# EasyEDA Pro project REV5.eprj

# Schematic UNCZ SLIME REV05
Board Name: Board1; Create Date: 2026-05-08; Page Name: P1; Project Name: REV5; Schematic Name: UNCZ SLIME REV05; Update Date: 2026-05-22; Company: UNCZ; Page Size: A4; Version: REV 5
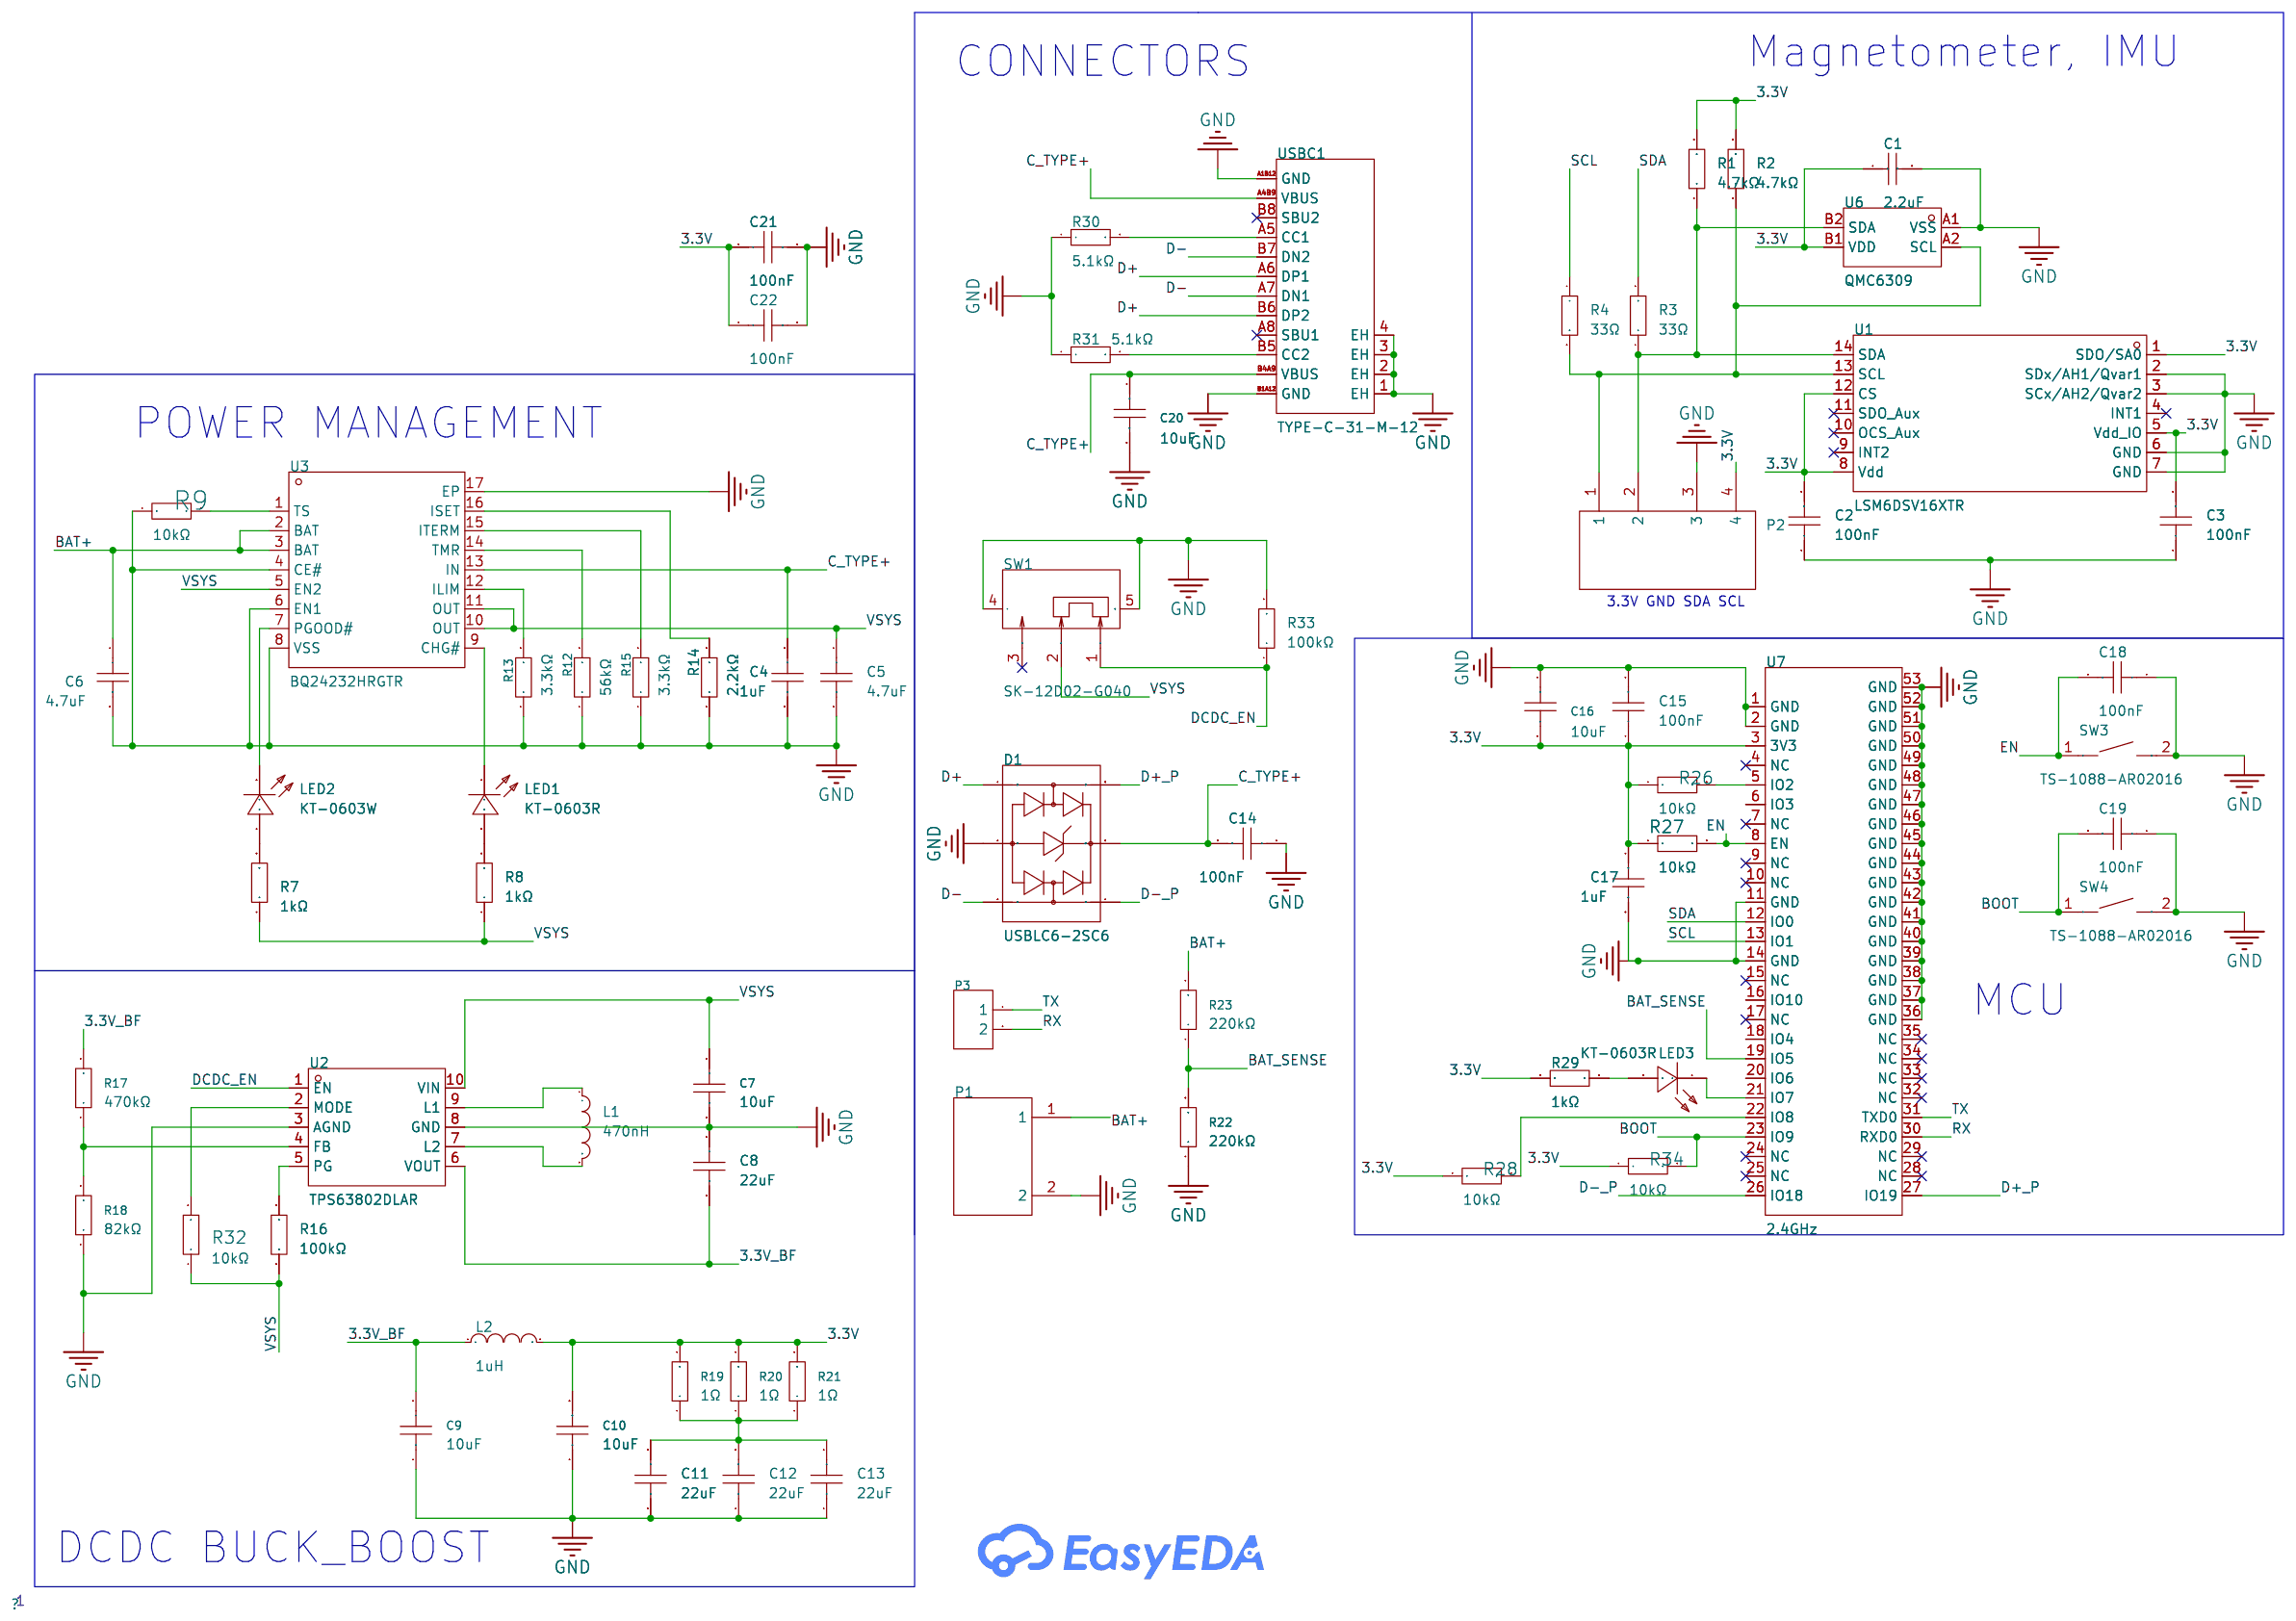
[diagram p0: schematic sheet]

## Parts
C1  2.2uF  [C0603]
C2  100nF  [C0603]
C3  100nF  [C0603]
C4  1uF  [C0603]
C5  4.7uF  [C0603]
C6  4.7uF  [C0603]
C7  10uF  [C0603]
C8  22uF  [C0805]
C9  10uF  [C0603]
C10  10uF  [C0603]
C11  22uF  [C0805]
C12  22uF  [C0805]
C13  22uF  [C0805]
C14  100nF  [C0603]
C15  100nF  [C0603]
C16  10uF  [C0603]
C17  1uF  [C0603]
C18  100nF  [C0603]
C19  100nF  [C0603]
C20  10uF  [C0603]
C21  100nF  [C0402]
C22  100nF  [C0402]
D1  USBLC6-2SC6  [SOT-23-6_L2.9-W1.6-P0.95-LS2.8-BL]
L1  470nH  [IND-SMD_L2.0-W1.6-1]  (no BOM)
L2  1uH  [IND-SMD_L3.2-W2.5-1]  (no BOM)
LED1  KT-0603R  [LED0603-RD_1]
LED2  KT-0603W  [LED0603-R-RD_WHITE]
LED3  KT-0603R  [LED0603-RD_1]
P1  -  [SMW-250-02P]  (no BOM)
P2  -  [SMW-250-04P]  (no BOM)
P3  -  [HDR-TH_2P-P2.54-V-F]  (no BOM)
R1  4.7kΩ  [R0603]
R2  4.7kΩ  [R0603]
R3  33Ω  [R0603]
R4  33Ω  [R0603]
R7  1kΩ  [R0603]
R8  1kΩ  [R0603]
R9  10kΩ  [R0603]
R12  56kΩ  [R0603]
R13  3.3kΩ  [R0603]
R14  2.2kΩ  [R0603]
R15  3.3kΩ  [R0603]
R16  100kΩ  [R0603]
R17  470kΩ  [R0603]
R18  82kΩ  [R0603]
R19  1Ω  [R0603]
R20  1Ω  [R0603]
R21  1Ω  [R0603]
R22  220kΩ  [R0603]
R23  220kΩ  [R0603]
R26  10kΩ  [R0603]
R27  10kΩ  [R0603]
R28  10kΩ  [R0603]
R29  1kΩ  [R0603]
R30  5.1kΩ  [R0603]
R31  5.1kΩ  [R0603]
R32  10kΩ  [R0603]
R33  100kΩ  [R0603]
R34  10kΩ  [R0603]
SW1  SK-12D02-G040  [SW-TH_SK-12D02-G040]  (no BOM)
SW3  TS-1088-AR02016  [SW-SMD_L3.9-W3.0-P4.45]
SW4  TS-1088-AR02016  [SW-SMD_L3.9-W3.0-P4.45]
U1  LSM6DSV16XTR  [LGA-14_L3.0-W2.5-P0.50-BR]
U2  TPS63802DLAR  [VSON-10_L3.0-W2.0-P0.50-TL]
U3  BQ24232HRGTR  [VQFN-16_L3.0-W3.0-P0.50-TL-EP1.7]
U6  QMC6309  [X1-WLB0808-4_L0.8-W0.8-P0.40-TL]
U7  2.4GHz  [WIFIM-SMD_ESP32-C3-MINI-1]
USBC1  TYPE-C-31-M-12  [USB-C_SMD-TYPE-C-31-M-12_1]

## Library data of the parts
C1 = CL10A225KO8NNNC: LCSC Part Name: 2.2uF ±10% 16V; Supplier Part: C23630; Manufacturer: SAMSUNG(三星); Supplier Footprint: 0603; JLCPCB Part Class: Basic Part; Datasheet: https://item.szlcsc.com/datasheet/CL10A225KO8NNNC/24366.html; Supplier: LCSC; Tolerance: ±10%; Voltage Rating: 16V; Temperature Coefficient: X5R; Check: true
C2 C3 C14 C15 C18 C19 = CC0603KRX7R9BB104: LCSC Part Name: 100nF ±10% 50V; Supplier Part: C14663; Manufacturer: YAGEO(国巨); Supplier Footprint: 0603; JLCPCB Part Class: Basic Part; Datasheet: https://item.szlcsc.com/datasheet/CC0603KRX7R9BB104/15331.html; Supplier: LCSC; Tolerance: ±10%; Voltage Rating: 50V; Temperature Coefficient: X7R; Check: true
C4 C17 = CL10A105KB8NNNC: LCSC Part Name: 1uF ±10% 50V; Supplier Part: C15849; Manufacturer: SAMSUNG(三星); Supplier Footprint: 0603; JLCPCB Part Class: Basic Part; Datasheet: https://item.szlcsc.com/datasheet/CL10A105KB8NNNC/16531.html; Supplier: LCSC; Tolerance: ±10%; Voltage Rating: 50V; Temperature Coefficient: X5R; Check: true
C5 C6 = CL10A475KO8NNNC: LCSC Part Name: 4.7uF ±10% 16V; Supplier Part: C19666; Manufacturer: SAMSUNG(三星); Supplier Footprint: 0603; JLCPCB Part Class: Basic Part; Datasheet: https://item.szlcsc.com/datasheet/CL10A475KO8NNNC/20375.html; Supplier: LCSC; Tolerance: ±10%; Voltage Rating: 16V; Temperature Coefficient: X5R; Check: true
C7 C9 C10 C16 C20 = CL10A106MA8NRNC: LCSC Part Name: 10uF ±20% 25V; Supplier Part: C96446; Manufacturer: SAMSUNG(三星); Supplier Footprint: 0603; JLCPCB Part Class: Basic Part; Datasheet: https://item.szlcsc.com/datasheet/CL10A106MA8NRNC/97651.html; Supplier: LCSC; Tolerance: ±20%; Voltage Rating: 25V; Temperature Coefficient: X5R; Check: true
C8 C11-C13 = CL21A226MAQNNNE: LCSC Part Name: 22uF ±20% 25V; Supplier Part: C45783; Manufacturer: SAMSUNG(三星); Supplier Footprint: 0805; JLCPCB Part Class: Basic Part; Datasheet: https://item.szlcsc.com/datasheet/CL21A226MAQNNNE/46786.html; Supplier: LCSC; Tolerance: ±20%; Voltage Rating: 25V; Temperature Coefficient: X5R; Check: true
C21 C22 = CL05B104KO5NNNC: LCSC Part Name: 100nF ±10% 16V; Supplier Part: C1525; Manufacturer: SAMSUNG(三星); Supplier Footprint: 0402; JLCPCB Part Class: Basic Part; Datasheet: https://item.szlcsc.com/datasheet/CL05B104KO5NNNC/1877.html; Supplier: LCSC; Tolerance: ±10%; Voltage Rating: 16V; Temperature Coefficient: X7R
D1 = USBLC6-2SC6_C21713975: LCSC Part Name: 丝印UL26 单向TVS 5V截止 峰值脉冲电流：4.5A@8/20us; Supplier Part: C21713975; Manufacturer: GOODWORK(固得沃克); Supplier Footprint: SOT-23-6; JLCPCB Part Class: Extended Part; Datasheet: https://item.szlcsc.com/datasheet/USBLC6-2SC6/23140168.html; Supplier: LCSC; Polarity: Unidirectional; Reverse Stand-Off Voltage (Vrwm): 5V; Clamping Voltage: 14V; Peak Pulse Current (Ipp): 4.5A@8/20us; Peak Pulse Power Dissipation (Ppp): 60W@8/20us; Voltage - Breakdown: 6V; Reverse Leakage Current (Ir): 500nA; Number of Channels: 2; Operating Temperature: -55℃~+125℃; level of protection: IEC 61000-4-5；IEC 61000-4-2; Type: TVS; Junction Capacitance: 0.6pF
L1 = DFE201612E-R47M=P2: LCSC Part Name: 470nH ±20% 5.5A; Supplier Part: C668312; Manufacturer: muRata(村田); Supplier Footprint: 0806; JLCPCB Part Class: Extended Part; Datasheet: https://atta.szlcsc.com/upload/public/pdf/source/20220704/803E7827D5B93CBE7ABCC328F9E8474C.pdf; Supplier: LCSC; Tolerance: ±20%; Current Rating: 4.5A; Current - Saturation(Isat): 5.5A; DC Resistance(DCR): 26mΩ
L2 = TMS322512ALM-1R0MTAA: LCSC Part Name: 1uH ±20% 4.6A; Supplier Part: C5159968; Manufacturer: TDK; Supplier Footprint: 1210; JLCPCB Part Class: Extended Part; Datasheet: https://atta.szlcsc.com/upload/public/pdf/source/20240117/93D08EA87E96D4335E3C24C1E97B0685.pdf; Supplier: LCSC; Tolerance: ±20%; Saturation Current (Isat): 4.6A
LED1 LED3 = KT-0603R: LCSC Part Name: 0603 红灯 高亮; Supplier Part: C2286; Manufacturer: KENTO; Supplier Footprint: 0603; JLCPCB Part Class: Basic Part; Datasheet: https://item.szlcsc.com/datasheet/KT-0603R/2659.html; Supplier: LCSC; Illumination Color: Red; Voltage - Forward(Vf): 1.8V~2.4V; Power(Watts): 40mW; Forward Current: 20mA; Wavelength - Dominant: 615nm~630nm; Peak Wavelength: 645nm; Diode Configuration: Discrete Diode; Lens Color: Water Clear; Luminous Intensity: 300mcd; Viewing Angle: 120°; Operating Temperature: -40℃~+85℃; Check: true
LED2 = KT-0603W: LCSC Part Name: 0603 白灯 高亮; Supplier Part: C2290; Manufacturer: KENTO; Supplier Footprint: 0603; JLCPCB Part Class: Basic Part; Datasheet: https://item.szlcsc.com/datasheet/KT-0603W/2663.html; Supplier: LCSC; Illumination Color: White; Voltage - Forward(Vf): 2.6V~3.1V; Power(Watts): 100mW; Forward Current: 5mA; Diode Configuration: Discrete Diode; Lens Color: Yellow Lens; Luminous Intensity: 360mcd; Viewing Angle: 120°; Mounting Style: Top-mount; Operating Temperature: -40℃~+85℃; Check: true
P1 = SMW-250-02P
P2 = SMW-250-04P
P3 = HDR-F_2.54_1x2P: Supplier Footprint: Through
R1 R2 = 0603WAF4701T5E: LCSC Part Name: 4.7kΩ ±1% 100mW 厚膜电阻; Supplier Part: C23162; Manufacturer: UNI-ROYAL(厚声); Supplier Footprint: 0603; JLCPCB Part Class: Basic Part; Datasheet: https://item.szlcsc.com/datasheet/0603WAF4701T5E/23889.html; Supplier: LCSC; Type: Thick Film Resistor; Tolerance: ±1%; Power(Watts): 100mW; Voltage-Supply(Max): 75V; Temperature Coefficient: ±100ppm/℃; Operating Temperature: -55℃~+155℃; Check: true
R3 R4 = 0603WAF330JT5E: LCSC Part Name: 33Ω ±1% 100mW 厚膜电阻; Supplier Part: C23140; Manufacturer: UNI-ROYAL(厚声); Supplier Footprint: 0603; JLCPCB Part Class: Basic Part; Datasheet: https://item.szlcsc.com/datasheet/0603WAF330JT5E/23867.html; Supplier: LCSC; Type: Thick Film Resistor; Tolerance: ±1%; Power(Watts): 100mW; Voltage-Supply(Max): 75V; Temperature Coefficient: ±100ppm/℃; Operating Temperature: -55℃~+155℃; Check: true
R7 R8 R29 = 0603WAF1001T5E: LCSC Part Name: 1kΩ ±1% 100mW 厚膜电阻; Supplier Part: C21190; Manufacturer: UNI-ROYAL(厚声); Supplier Footprint: 0603; JLCPCB Part Class: Basic Part; Datasheet: https://item.szlcsc.com/datasheet/0603WAF1001T5E/21904.html; Supplier: LCSC; Type: Thick Film Resistor; Tolerance: ±1%; Power(Watts): 100mW; Voltage-Supply(Max): 75V; Temperature Coefficient: ±100ppm/℃; Operating Temperature: -55℃~+155℃; Check: true
R9 R26-R28 R32 R34 = 0603WAF1002T5E: LCSC Part Name: 厚膜电阻 10kΩ ±1% 100mW; Supplier Part: C25804; Manufacturer: UNI-ROYAL(厚声); Supplier Footprint: 0603; JLCPCB Part Class: Basic Part; Datasheet: https://item.szlcsc.com/datasheet/0603WAF1002T5E/26547.html; Supplier: LCSC; Type: Thick Film Resistor; Tolerance: ±1%; Power(Watts): 100mW; Voltage-Supply(Max): 75V; Temperature Coefficient: ±100ppm/℃; Operating Temperature: -55℃~+155℃; Check: true
R12 = 0603WAF5602T5E: LCSC Part Name: 56kΩ ±1% 100mW 厚膜电阻; Supplier Part: C23206; Manufacturer: UNI-ROYAL(厚声); Supplier Footprint: 0603; JLCPCB Part Class: Basic Part; Datasheet: https://item.szlcsc.com/datasheet/0603WAF5602T5E/23933.html; Supplier: LCSC; Type: Thick Film Resistor; Tolerance: ±1%; Power(Watts): 100mW; Voltage-Supply(Max): 75V; Temperature Coefficient: ±100ppm/℃; Operating Temperature: -55℃~+155℃; Check: true
R13 R15 = 0603WAF3301T5E: LCSC Part Name: 3.3kΩ ±1% 100mW 厚膜电阻; Supplier Part: C22978; Manufacturer: UNI-ROYAL(厚声); Supplier Footprint: 0603; JLCPCB Part Class: Basic Part; Datasheet: https://item.szlcsc.com/datasheet/0603WAF3301T5E/23705.html; Supplier: LCSC; Type: Thick Film Resistor; Tolerance: ±1%; Power(Watts): 100mW; Voltage-Supply(Max): 75V; Temperature Coefficient: ±100ppm/℃; Operating Temperature: -55℃~+155℃; Check: true
R14 = 0603WAF2201T5E_C4190: LCSC Part Name: 2.2kΩ ±1% 100mW 厚膜电阻; Supplier Part: C4190; Manufacturer: UNI-ROYAL(厚声); Manufacturer Part: 0603WAF2201T5E; Supplier Footprint: 0603; JLCPCB Part Class: Basic Part; Datasheet: https://atta.szlcsc.com/upload/public/pdf/source/20200306/C422600_1E6D84923E4A46A82E41ADD87F860B5C.pdf; Supplier: LCSC; Type: Thick Film Resistors; Tolerance: ±1%; Temperature Coefficient: ±100ppm/℃; Operating Temperature Range: -55℃~+155℃; Check: true
R16 R33 = 0603WAF1003T5E: LCSC Part Name: 100kΩ ±1% 100mW 厚膜电阻; Supplier Part: C25803; Manufacturer: UNI-ROYAL(厚声); Supplier Footprint: 0603; JLCPCB Part Class: Basic Part; Datasheet: https://item.szlcsc.com/datasheet/0603WAF1003T5E/26546.html; Supplier: LCSC; Type: Thick Film Resistor; Tolerance: ±1%; Power(Watts): 100mW; Voltage-Supply(Max): 75V; Temperature Coefficient: ±100ppm/℃; Operating Temperature: -55℃~+155℃; Check: true
R17 = 0603WAF4703T5E: LCSC Part Name: 470kΩ ±1% 100mW 厚膜电阻; Supplier Part: C23178; Manufacturer: UNI-ROYAL(厚声); Supplier Footprint: 0603; JLCPCB Part Class: Basic Part; Datasheet: https://item.szlcsc.com/datasheet/0603WAF4703T5E/23905.html; Supplier: LCSC; Type: Thick Film Resistor; Tolerance: ±1%; Power(Watts): 100mW; Voltage-Supply(Max): 75V; Temperature Coefficient: ±100ppm/℃; Operating Temperature: -55℃~+155℃; Check: true
R18 = 0603WAF8202T5E: LCSC Part Name: 82kΩ ±1% 100mW 厚膜电阻; Supplier Part: C23254; Manufacturer: UNI-ROYAL(厚声); Supplier Footprint: 0603; JLCPCB Part Class: Basic Part; Datasheet: https://item.szlcsc.com/datasheet/0603WAF8202T5E/23981.html; Supplier: LCSC; Type: Thick Film Resistor; Tolerance: ±1%; Power(Watts): 100mW; Voltage-Supply(Max): 75V; Temperature Coefficient: ±100ppm/℃; Operating Temperature: -55℃~+155℃; Check: true
R19-R21 = 0603WAF100KT5E: LCSC Part Name: 1Ω ±1% 100mW 厚膜电阻; Supplier Part: C22936; Manufacturer: UNI-ROYAL(厚声); Supplier Footprint: 0603; JLCPCB Part Class: Basic Part; Datasheet: https://item.szlcsc.com/datasheet/0603WAF100KT5E/23663.html; Supplier: LCSC; Type: Thick Film Resistor; Tolerance: ±1%; Power(Watts): 100mW; Voltage-Supply(Max): 75V; Temperature Coefficient: ±400ppm/℃; Operating Temperature: -55℃~+155℃; Check: true
R22 R23 = 0603WAF2203T5E: LCSC Part Name: 220kΩ ±1% 100mW 厚膜电阻; Supplier Part: C22961; Manufacturer: UNI-ROYAL(厚声); Supplier Footprint: 0603; JLCPCB Part Class: Basic Part; Datasheet: https://item.szlcsc.com/datasheet/0603WAF2203T5E/23688.html; Supplier: LCSC; Type: Thick Film Resistor; Tolerance: ±1%; Power(Watts): 100mW; Voltage-Supply(Max): 75V; Temperature Coefficient: ±100ppm/℃; Operating Temperature: -55℃~+155℃; Check: true
R30 R31 = 0603WAF5101T5E: LCSC Part Name: 5.1kΩ ±1% 100mW 厚膜电阻; Supplier Part: C23186; Manufacturer: UNI-ROYAL(厚声); Supplier Footprint: 0603; JLCPCB Part Class: Basic Part; Datasheet: https://item.szlcsc.com/datasheet/0603WAF5101T5E/23913.html; Supplier: LCSC; Type: Thick Film Resistor; Tolerance: ±1%; Power(Watts): 100mW; Voltage-Supply(Max): 75V; Temperature Coefficient: ±100ppm/℃; Operating Temperature: -55℃~+155℃; Check: true
SW1 = SK-12D02-G040: LCSC Part Name: 柄长4mm 卧插两档 滑动开关; Supplier Part: C2930976; Manufacturer: G-Switch(品赞); Supplier Footprint: 弯插,8.6x4.7mm; JLCPCB Part Class: Extended Part; Datasheet: https://item.szlcsc.com/datasheet/SK-12D02-G040/3269893.html; Supplier: LCSC; Circuit: SPDT; Actuator Style: Rectangular Columnar; Termination Style: PC Pin; Length: 8.6mm; Width: 4.7mm; Switch Height: 8.5mm; Mounting Type: Right Angle; Actuator Color: Black; Current Rating: 1A; Voltage Rating: 24V; Life: 10,000 Cycles; Operating Temperature: -25℃~+70℃
SW3 SW4 = TS-1088-AR02016: LCSC Part Name: 4*3*2mm 立贴 轻触开关; Supplier Part: C720477; Manufacturer: XUNPU(讯普); Supplier Footprint: SMD,4x3mm; JLCPCB Part Class: Basic Part; Datasheet: https://item.szlcsc.com/datasheet/TS-1088-AR02016/763484.html; Supplier: LCSC; Circuit: SPST; Actuator Style: Round Button; Operating Force: 1.6N; Mounting Type: Surface Mount,Vertical; Length: 4mm; Width: 3mm; Switch Height: 2mm; with Bracket: Without Bracket; Contact Current: 50mA; Voltage Rating: 12V; Actuator/Cap Color: Black; Termination Style: SMD(SMT) Tab; Life: 100,000 Cycles; Operating Temperature: -30℃~+80℃; Check: true
U1 = LSM6DSV16XTR: LCSC Part Name: 适用于高端应用的六轴惯性测量单元（IMU）和具备嵌入式传感器融合功能的Al传感器、Qvar; Supplier Part: C5267406; Manufacturer: ST(意法半导体); Supplier Footprint: LGA-14(2.5x3); JLCPCB Part Class: Extended Part; Datasheet: https://item.szlcsc.com/datasheet/LSM6DSV16XTR/5993815.html; Supplier: LCSC; Accelerometer Sensing Axis: X,Y,Z; Acceleration Measurement Range (MAX): ±16g; Gyroscope Sensing Axis: X,Y,Z; Gyroscope Measurement Range (MAX): ±4000dps; Sensor Type: IMU (accelerometer + gyroscope); Interface: I2C；SPI; Voltage - Supply: 1.71V~3.6V; Cache Size: 4.5KB; Standby Current: 2.6uA; Operating Temperature: -40℃~+85℃; Features: Motion event detection；Synchronization and timestamp; Check: true
U2 = TPS63802DLAR_C2845237: LCSC Part Name: 采用DFN封装的高效率、低IQ降压/升压转换器; Supplier Part: C2845237; Manufacturer: TI(德州仪器); Supplier Footprint: VSON-10(2x3); JLCPCB Part Class: Extended Part; Datasheet: https://www.ti.com/cn/lit/gpn/tps63802; Supplier: LCSC; Function: Buck-Boost; Voltage - Supply: 1.3V~5.5V; Output Current: 2A; Frequency - Switching: 2.1MHz；1.4MHz；1.6MHz; Operating Temperature: -40℃~+125℃@(TJ); Number of Outputs: 1; Topology: Buck-Boost; Switch tube (built-in/external): Built-In; Check: true
U3 = BQ24232HRGTR: Supplier Part: C575586; Manufacturer: TI(德州仪器); Supplier Footprint: VQFN-16-EP(3x3); JLCPCB Part Class: Extended Part; Datasheet: https://www.ti.com/cn/lit/gpn/bq24232h; Supplier: LCSC; Voltage - Supply: 4.35V~10.2V; Charging Saturation Voltage: 4.35V; Type of Battery: Lithium-ion/Polymer; Number of Cells: 1; Operating Temperature: -40℃~+85℃; Check: true
U6 = QMC6309: LCSC Part Name: 三轴单芯片磁传感器; Supplier Part: C5439871; Manufacturer: QST(上海矽睿); Supplier Footprint: WLCSP-4(0.8x0.8); JLCPCB Part Class: Extended Part; Datasheet: https://item.szlcsc.com/datasheet/QMC6309/6319593.html; Supplier: LCSC; Magnetic Sensing Range(X,Y): ±3.2mT; Magnetic Sensing Range(Z): ±3.2mT; Output bit: 16bit; Interface Type: I2C; Voltage - Supply: 2.5V~3.6V; Current - Supply: 10uA；6uA; Operating Temperature: -40℃~+85℃; Check: true
U7 = ESP32-C3-MINI-1-H4X: LCSC Part Name: 不带固件 支持2.4GHz Wi-Fi和蓝牙5的小尺寸模组; Supplier Part: C41349510; Manufacturer: ESPRESSIF(乐鑫); Supplier Footprint: SMD,16.6x13.2mm; JLCPCB Part Class: Extended Part; Datasheet: https://item.szlcsc.com/datasheet/ESP32-C3-MINI-1-H4X/43083447.html; Supplier: LCSC; Utilized IC / Part: ESP32-C3FH4; Interface Type: I2C；GPIO；UART；SPI；USB；I2S; Antenna Type: On-board PCB Antenna; Output Power: 20.5dBm; Voltage - Supply: 3V~3.6V; Receive  Current: 82mA; Send  Current: 350mA; Sensitivity: -104dBm; Operating Temperature: -40℃~+105℃; Check: true
USBC1 = TYPE-C-31-M-12: LCSC Part Name: Type-C 母 卧贴; Supplier Part: C165948; Manufacturer: 韩国韩荣; Supplier Footprint: SMD; JLCPCB Part Class: Extended Part; Datasheet: https://item.szlcsc.com/datasheet/TYPE-C-31-M-12/177331.html; Supplier: LCSC; Connector Type: Type-C; Gender: Female; Mounting Type: Surface Mount, Right Angle; Number of Contacts: 16P; Number of Ports: 1; Current Rating-Power: 5A; Voltage Rating: 20V; Connect-Disconnect Life: 10,000 cycles; Length: 7.35mm; Operating Temperature: -30℃~+80℃; Check: true

## Nets
3.3V: C1.1 C2.2 C3.2 C10.2 C15.1 C16.2 C17.1 C21.1 C22.1 L2.2 P2.4 R1.2 R2.2 R19.2 R20.2 R21.2 R26.1 R27.1 R28.1 R29.2 R34.1 U1.1(SDO/SA0) U1.5(Vdd_IO) U1.8(Vdd) U1.12(CS) U6.B1(VDD) U7.3(3V3)
3.3V_BF: C8.2 C9.2 L2.1 R17.2 U2.6(VOUT)
GND: C1.2 C2.1 C3.1 C4.2 C5.2 C6.2 C7.2 C8.1 C9.1 C10.1 C11.1 C12.1 C13.1 C14.1 C15.2 C16.1 C17.2 C18.1 C19.1 C20.2 C21.2 C22.2 D1.2(GND) P1.2 P2.3 R9.1 R12.1 R13.1 R14.1 R15.1 R18.1 R22.1 R30.1 R31.1 R33.2 SW1.4 SW1.5 SW3.2 SW4.2 U1.2(SDx/AH1/Qvar1) U1.3(SCx/AH2/Qvar2) U1.6(GND) U1.7(GND) U2.3(AGND) U2.8(GND) U3.4(CE#) U3.6(EN1) U3.8(VSS) U3.17(EP) U6.A1(VSS) U7.1(GND) U7.2(GND) U7.11(GND) U7.14(GND) U7.36(GND) U7.37(GND) U7.38(GND) U7.39(GND) U7.40(GND) U7.41(GND) U7.42(GND) U7.43(GND) U7.44(GND) U7.45(GND) U7.46(GND) U7.47(GND) U7.48(GND) U7.49(GND) U7.50(GND) U7.51(GND) U7.52(GND) U7.53(GND) USBC1.1(EH) USBC1.2(EH) USBC1.3(EH) USBC1.4(EH) USBC1.A1B12(GND) USBC1.B1A12(GND)
BAT+: C6.1 P1.1 R23.2 U3.2(BAT) U3.3(BAT)
BAT_SENSE: R22.2 R23.1 U7.19(IO5)
BOOT: C19.2 R34.2 SW4.1 U7.23(IO9)
C_TYPE+: C4.1 C14.2 C20.1 D1.5(VBUS) U3.13(IN) USBC1.A4B9(VBUS) USBC1.B4A9(VBUS)
D+: D1.1(I/O1) USBC1.A6(DP1) USBC1.B6(DP2)
D+_P: D1.6(I/O1) U7.27(IO19)
D-: D1.3(I/O2) USBC1.A7(DN1) USBC1.B7(DN2)
D-_P: D1.4(I/O2) U7.26(IO18)
DCDC_EN: R33.1 SW1.1 U2.1(EN)
EN: C18.2 R27.2 SW3.1 U7.8(EN)
RX: P3.2 U7.30(RXD0)
SCL: R4.1 U7.13(IO1)
SDA: R3.2 U7.12(IO0)
TX: P3.1 U7.31(TXD0)
VSYS: C5.1 C7.1 R7.1 R8.1 R16.1 R32.1 SW1.2 U2.10(VIN) U3.5(EN2) U3.10(OUT) U3.11(OUT)
$1N2531: P2.1 R2.1 R4.2 U1.13(SCL) U6.A2(SCL)
$1N4169: LED1.1(K) U3.9(CHG#)
$1N4171: LED2.2(K) U3.7(PGOOD#)
$1N4227: LED2.1(A) R7.2
$1N4266: LED1.2(A) R8.2
$1N4379: R9.2 U3.1(TS)
$1N4549: R13.2 U3.12(ILIM)
$1N4656: R14.2 U3.16(ISET)
$1N4782: R12.2 U3.14(TMR)
$1N5007: R15.2 U3.15(ITERM)
$1N5303: L1.1 U2.9(L1)
$1N5309: L1.2 U2.7(L2)
$1N5390: R16.2 U2.5(PG)
$1N5546: R17.1 R18.2 U2.4(FB)
$1N6073: C11.2 C12.2 C13.2 R19.1 R20.1 R21.1
$1N10568: R26.2 U7.5(IO2)
$1N10729: R28.2 U7.22(IO8)
$1N11137: LED3.1(K) U7.21(IO7)
$1N11183: LED3.2(A) R29.1
$1N11433: R30.2 USBC1.A5(CC1)
$1N11435: R31.2 USBC1.B5(CC2)
$1N15347: R32.2 U2.2(MODE)
$1N24447: P2.2 R1.1 R3.1 U1.14(SDA) U6.B2(SDA)

Not connected (* = marked no-connect by the designer): SW1 3*; U1 4(INT1)* 9(INT2)* 10(OCS_Aux)* 11(SDO_Aux)*; U7 4(NC)* 6(IO3) 7(NC)* 9(NC)* 10(NC)* 15(NC)* 16(IO10) 17(NC)* 18(IO4) 20(IO6) 24(NC)* 25(NC)* 28(NC)* 29(NC)* 32(NC)* 33(NC)* 34(NC)* 35(NC)*; USBC1 A8(SBU1)* B8(SBU2)*

## Notes on the sheet
- CONNECTORS
- Magnetometer, IMU
- POWER MANAGEMENT
- 3.3V GND SDA SCL
- MCU
- DCDC BUCK_BOOST

# Board PCB1
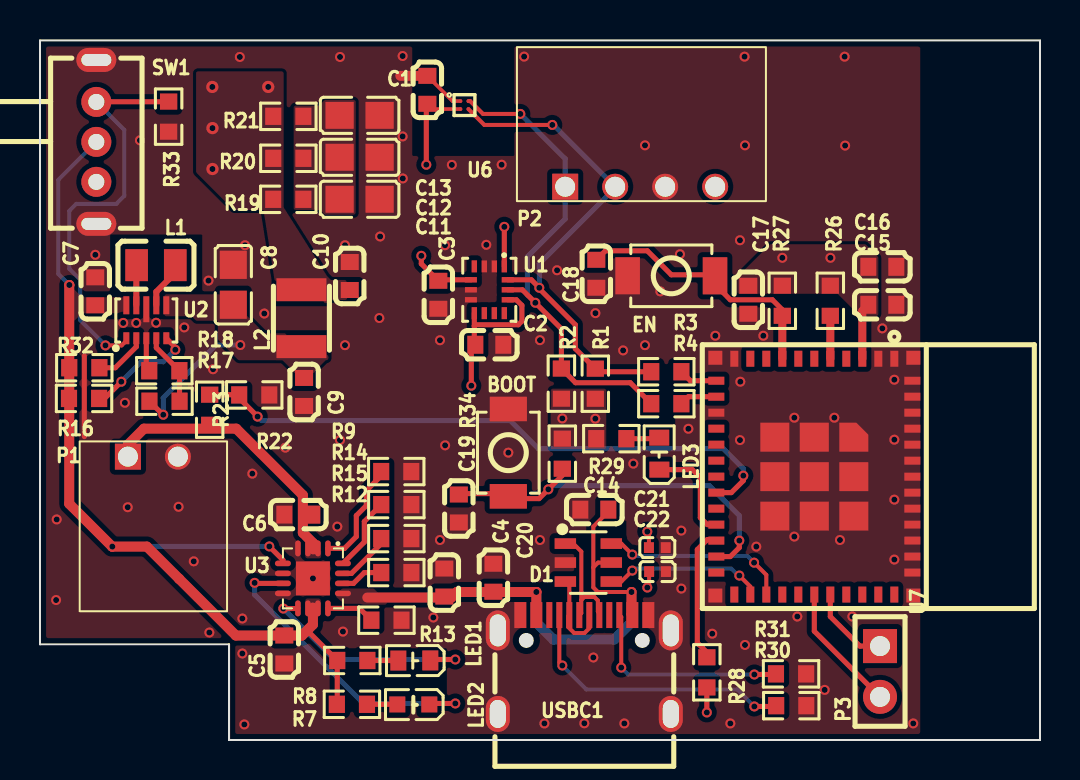
[diagram p1: board, top side]
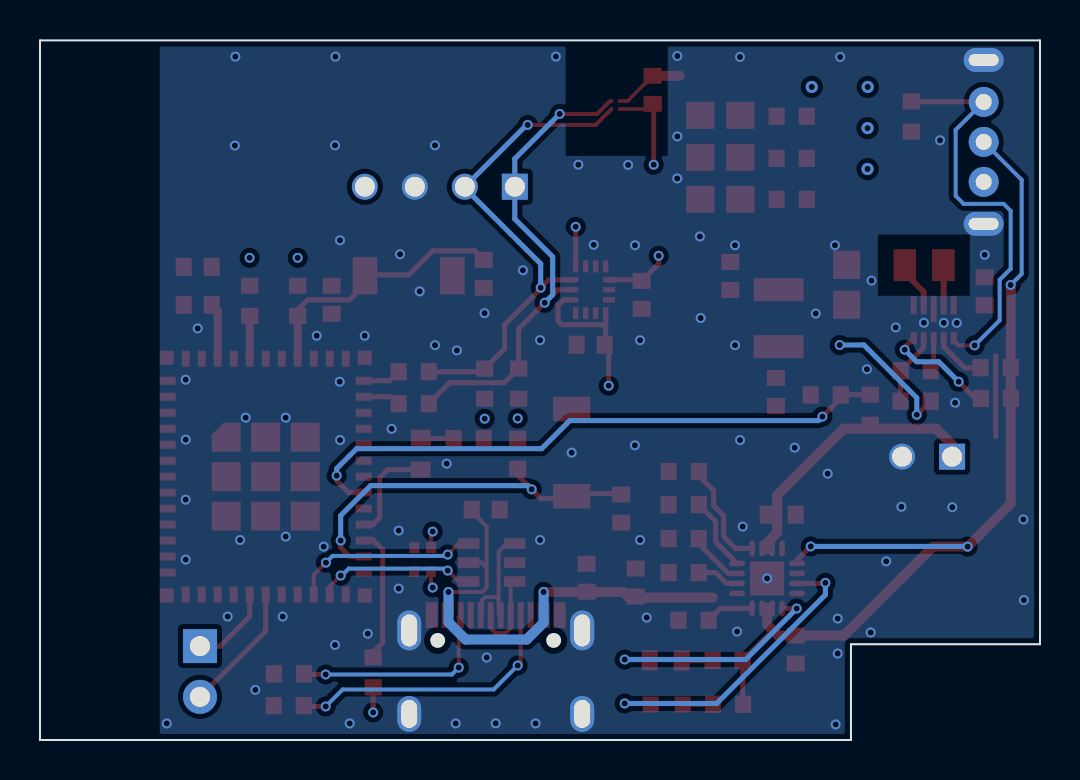
[diagram p2: board, bottom side, seen from below]

Outline 50 x 35.01 mm; copper layers: Top Layer, Inner1, Inner2, Bottom Layer. Coordinates in mm from the lower left corner of the outline.
Outline path: 0,35.01 0,4.79 9.45,4.79 9.45,0 50,0 50,35.01 0,35.01
Stack: Top Layer 0.035mm Outer layer thickness 1oz / Dielectric1 0.2104mm 7628 RC49% 8.6mil / Inner1 0.0152mm Inner layer thickness / Dielectric2 1.065mm 1.1mm H/HOZ Copper / Inner2 0.0152mm Inner layer thickness / Dielectric3 0.2104mm 7628 RC49% 8.6mil / Bottom Layer 0.035mm Outer layer thickness 1oz

## Design rules (mm)
template: Custom Config
spacing copperThickness1oz (default): track to track 0.102, other pairs 0.152 to 0.3
spacing copperThickness2oz: track to track 0.203, other pairs 0.152 to 0.3
track width copperThickness1oz (default): min 0.127, default 0.254, max 2.54
track width copperThickness2oz: min 0.203, default 0.254, max 2.54
differential pair differentialPair (default): width min 0.127, default 0.254, max 2.54; gap min 0.152, default 0.152
via viaSize (default): diameter min 0.5, default 0.5, max 10; hole min 0.3, default 0.305, max 6.3
net 3.3V uses copperRegion1
net VSYS uses copperRegion1
net $1N5303 uses copperRegion1
net $1N5309 uses copperRegion1
net BAT+ uses copperRegion1
net 3.3V_BF uses copperRegion1
pour e732 uses copperRegion1
pour e1700 uses copperRegion1
pour e1703 uses copperRegion1
pour e1796 uses copperRegion1
pour e1802 uses copperRegion1
pour e1811 uses copperRegion1
pour e1922 uses copperRegion1
pour e1860 uses copperRegion1
pour e2965 uses copperRegion1
pour e775 uses copperRegion1
pour e794 uses copperRegion1

## Placement (name value [footprint] x y rotation side)
BOOT  TS-1088-AR02016  [SW-SMD_L3.9-W3.0-P4.45]  23.42 14.38 90 top
C1  2.2uF  [C0603]  19.37 32.53 90 top
C2  100nF  [C0603]  22.47 19.78 180 top
C3  100nF  [C0603]  19.92 22.28 90 top
C4  1uF  [C0603]  20.22 7.88 90 top
C5  4.7uF  [C0603]  12.22 4.53 270 top
C6  4.7uF  [C0603]  12.92 11.28 180 top
C7  10uF  [C0603]  2.76 22.45 90 top
C8  22uF  [C0805]  9.67 22.78 270 top
C9  10uF  [C0603]  13.21 17.42 90 top
C10  10uF  [C0603]  15.49 23.22 270 top
C11  22uF  [C0805]  15.98 27.06 180 top
C12  22uF  [C0805]  15.98 29.16 180 top
C13  22uF  [C0805]  15.98 31.26 180 top
C14  100nF  [C0603]  27.72 11.53 0 top
C15  100nF  [C0603]  42.12 21.78 0 top
C16  10uF  [C0603]  42.12 23.68 180 top
C17  1uF  [C0603]  35.42 22.03 270 top
C18  100nF  [C0603]  27.82 23.33 90 top
C19  100nF  [C0603]  20.94 11.59 90 top
C20  10uF  [C0603]  22.67 8.12 90 top
C21  100nF  [C0402]  30.87 9.63 0 top
C22  100nF  [C0402]  30.88 8.43 0 top
D1  USBLC6-2SC6  [SOT-23-6_L2.9-W1.6-P0.95-LS2.8-BL]  27.42 8.88 270 top
EN  TS-1088-AR02016  [SW-SMD_L3.9-W3.0-P4.45]  31.57 23.23 180 top
L1  470nH  [IND-SMD_L2.0-W1.6-1]  5.8 23.76 0 top
L2  1uH  [IND-SMD_L3.2-W2.5-1]  13.07 21.11 90 top
LED1  KT-0603R  [LED0603-RD_1]  18.72 3.98 180 top
LED2  KT-0603W  [LED0603-R-RD_WHITE]  18.67 1.78 180 top
LED3  KT-0603R  [LED0603-RD_1]  30.97 14.33 90 top
P1  -  [SMW-250-02P]  5.67 14.18 0 top
P2  -  [SMW-250-04P]  29.94 27.69 0 top
P3  -  [HDR-TH_2P-P2.54-V-F]  42 3.43 270 top
R1  4.7kΩ  [R0603]  27.77 17.83 270 top
R2  4.7kΩ  [R0603]  26.07 17.83 270 top
R3  33Ω  [R0603]  31.32 18.43 0 top
R4  33Ω  [R0603]  31.32 16.83 180 top
R7  1kΩ  [R0603]  15.6 1.79 0 top
R8  1kΩ  [R0603]  15.62 3.98 0 top
R9  10kΩ  [R0603]  17.81 13.43 180 top
R12  56kΩ  [R0603]  17.82 8.38 180 top
R13  3.3kΩ  [R0603]  17.32 6 180 top
R14  2.2kΩ  [R0603]  17.82 11.78 180 top
R15  3.3kΩ  [R0603]  17.82 10.08 180 top
R16  100kΩ  [R0603]  2.2 17.09 0 top
R17  470kΩ  [R0603]  6.22 16.95 180 top
R18  82kΩ  [R0603]  6.22 18.48 0 top
R19  1Ω  [R0603]  12.41 27.06 180 top
R20  1Ω  [R0603]  12.42 29.11 180 top
R21  1Ω  [R0603]  12.42 31.21 180 top
R22  220kΩ  [R0603]  10.71 17.27 180 top
R23  220kΩ  [R0603]  8.49 16.53 270 top
R26  10kΩ  [R0603]  39.52 21.98 270 top
R27  10kΩ  [R0603]  37.12 21.98 270 top
R28  10kΩ  [R0603]  33.34 3.39 90 top
R29  1kΩ  [R0603]  28.57 15.08 180 top
R30  5.1kΩ  [R0603]  37.56 1.72 180 top
R31  5.1kΩ  [R0603]  37.55 3.31 180 top
R32  10kΩ  [R0603]  2.22 18.63 0 top
R33  100kΩ  [R0603]  6.43 31.19 270 top
R34  10kΩ  [R0603]  26.12 14.33 270 top
SW1  SK-12D02-G040  [SW-TH_SK-12D02-G040]  2.82 29.93 270 top
U1  LSM6DSV16XTR  [LGA-14_L3.0-W2.5-P0.50-BR]  22.47 22.53 90 top
U2  TPS63802DLAR  [VSON-10_L3.0-W2.0-P0.50-TL]  5.32 20.93 90 top
U3  BQ24232HRGTR  [VQFN-16_L3.0-W3.0-P0.50-TL-EP1.7]  13.65 8.09 270 top
U6  QMC6309  [X1-WLB0808-4_L0.8-W0.8-P0.40-TL]  21.22 31.77 0 top
U7  2.4GHz  [WIFIM-SMD_ESP32-C3-MINI-1]  38.72 13.18 270 top
USBC1  TYPE-C-31-M-12  [USB-C_SMD-TYPE-C-31-M-12_1]  27.22 3.78 0 top

## Footprints (pads in the part's own frame, mm; a bottom-side part is the same pattern mirrored in y, then rotated)
C0402
  rect 0.5x0.54 smd: 1(-0.42,0) 2(0.42,0)
C0603
  rect 0.8x0.9 smd: 1(-0.7,0) 2(0.7,0)
C0805
  rect 1.41x1.35 smd: 1(-1,0) 2(1,0)
HDR-TH_2P-P2.54-V-F
  rect 1.7x1.7 hole 1: 1(-1.27,0)
  round 1.7 hole 1: 2(1.27,0)
IND-SMD_L2.0-W1.6-1
  rect 1.133x1.6 smd: 1(-0.967,0) 2(0.967,0)
IND-SMD_L3.2-W2.5-1
  rect 1.15x2.5 smd: 1(-1.425,0) 2(1.425,0)
LED0603-R-RD_WHITE
  rect 0.8x0.8 smd: 1(0.8,0) 2(-0.8,0)
LED0603-RD_1
  rect 0.8x1 smd: 1(-0.799,-0.004) 2(0.799,0.004)
LGA-14_L3.0-W2.5-P0.50-BR
  rect 0.6x0.27 smd: 1(1.17,-0.75) 2(1.17,-0.25) 3(1.17,0.25) 4(1.17,0.75) 8(-1.17,0.75) 9(-1.17,0.25) 10(-1.17,-0.25) 11(-1.17,-0.75)
  rect 0.27x0.6 smd: 5(0.5,0.92) 6(0,0.92) 7(-0.5,0.92) 12(-0.5,-0.92) 13(0,-0.92) 14(0.5,-0.92)
R0603
  rect 0.806x0.864 smd: 1(-0.753,0) 2(0.753,0)
SMW-250-02P
  rect 1.3x1.3 hole 1: 1(-1.27,0)
  round 1.3 hole 1: 2(1.23,0)
SMW-250-04P
  rect 1.3x1.3 hole 1: 1(-3.683,0)
  round 1.3 hole 1: 2(-1.183,0) 3(1.317,0) 4(3.817,0)
SOT-23-6_L2.9-W1.6-P0.95-LS2.8-BL
  rect 0.532x1.072 smd: 1(-0.95,-1.149) 2(0,-1.149) 3(0.95,-1.149) 4(0.95,1.149) 5(0,1.149) 6(-0.95,1.149)
SW-SMD_L3.9-W3.0-P4.45
  rect 1.23x1.86 smd: 1(-2.185,0) 2(2.185,0)
SW-TH_SK-12D02-G040
  round 1.5 hole 0.8: 1(-2,0) 2(0,0) 3(2,0)
  oval 1.2x2 hole 0.6x1.5: 4(-4.1,0) 5(4.1,0)
USB-C_SMD-TYPE-C-31-M-12_1
  oval 1.2x2 hole 0.8x1.6: 1(4.325,1.706) 4(-4.325,1.706)
  oval 1.2x1.8 hole 0.8x1.4: 2(4.325,-2.474) 3(-4.325,-2.474)
  custom 0.6x1.3 smd: A1B12(-3.2,2.474) A4B9(-2.4,2.474) B1A12(3.2,2.474) B4A9(2.401,2.474)
  rect 0.3x1.3 smd: A5(-1.25,2.474) A6(-0.25,2.474) A7(0.25,2.474) A8(1.25,2.474) B5(1.75,2.474) B6(0.75,2.474) B7(-0.75,2.474) B8(-1.75,2.474)
VQFN-16_L3.0-W3.0-P0.50-TL-EP1.7
  oval 0.8x0.28 smd: 1(-1.5,0.75) 2(-1.5,0.25) 3(-1.5,-0.25) 4(-1.5,-0.75) 9(1.5,-0.75) 10(1.5,-0.25) 11(1.5,0.25) 12(1.5,0.75)
  oval 0.28x0.8 smd: 5(-0.75,-1.5) 6(-0.25,-1.5) 7(0.25,-1.5) 8(0.75,-1.5) 13(0.75,1.5) 14(0.25,1.5) 15(-0.25,1.5) 16(-0.75,1.5)
  rect 1.7x1.7 smd: 17(0,0)
VSON-10_L3.0-W2.0-P0.50-TL
  rect 0.6x0.3 smd: 1(-0.825,1) 2(-0.825,0.5) 3(-0.825,0) 4(-0.825,-0.5) 5(-0.825,-1)
  rect 0.9x0.3 smd: 6(0.825,-1) 7(0.825,-0.5) 9(0.825,0.5) 10(0.825,1)
  rect 1.3x0.3 smd: 8(0.625,0)
WIFIM-SMD_ESP32-C3-MINI-1
  rect 0.8x0.4 smd: 1(-5.9,4) 2(-5.9,3.2) 3(-5.9,2.4) 4(-5.9,1.6) 5(-5.9,0.8) 6(-5.9,0) 7(-5.9,-0.8) 8(-5.9,-1.6) 9(-5.9,-2.4) 10(-5.9,-3.2) 11(-5.9,-4) 25(5.9,-4) 26(5.9,-3.2) 27(5.9,-2.4) 28(5.9,-1.6) 29(5.9,-0.8) 30(5.9,0) 31(5.9,0.8) 32(5.9,1.6) 33(5.9,2.4) 34(5.9,3.2) 35(5.9,4)
  rect 0.4x0.8 smd: 12(-4.8,-4.9) 13(-4,-4.9) 14(-3.2,-4.9) 15(-2.4,-4.9) 16(-1.6,-4.9) 17(-0.8,-4.9) 18(0,-4.9) 19(0.8,-4.9) 20(1.6,-4.9) 21(2.4,-4.9) 22(3.2,-4.9) 23(4,-4.9) 24(4.8,-4.9) 36(4.8,4.9) 37(4,4.9) 38(3.2,4.9) 39(2.4,4.9) 40(1.6,4.9) 41(0.8,4.9) 42(0,4.9) 43(-0.8,4.9) 44(-1.6,4.9) 45(-2.4,4.9) 46(-3.2,4.9) 47(-4,4.9) 48(-4.8,4.9)
  custom 1.45x1.45 smd: 49(-1.975,1.975)
  rect 1.45x1.45 smd: 49(-1.975,0) 49(-1.975,-1.975) 49(0,1.975) 49(0,0) 49(0,-1.975) 49(1.975,1.975) 49(1.975,0) 49(1.975,-1.975)
  rect 0.7x0.7 smd: 50(5.95,4.95) 51(5.95,-4.95) 52(-5.95,-4.95) 53(-5.95,4.95)
X1-WLB0808-4_L0.8-W0.8-P0.40-TL
  round 0.18 smd: A1(-0.2,0.2) A2(0.2,0.2) B1(-0.2,-0.2) B2(0.2,-0.2)

## Nets
As in the schematic, except:
GND: BOOT.2 C1.2 C2.1 C3.1 C4.2 C5.2 C6.2 C7.2 C8.1 C9.1 C10.1 C11.1 C12.1 C13.1 C14.1 C15.2 C16.1 C17.2 C18.1 C19.1 C20.2 C21.2 C22.2 D1.2 EN.2 P1.2 P2.3 R9.1 R12.1 R13.1 R14.1 R15.1 R18.1 R22.1 R30.1 R31.1 R33.2 SW1.4 SW1.5 U1.2 U1.3 U1.6 U1.7 U2.3 U2.8 U3.4 U3.6 U3.8 U3.17 U6.A1 U7.1 U7.2 U7.11 U7.14 U7.36 U7.37 U7.38 U7.39 U7.40 U7.41 U7.42 U7.43 U7.44 U7.45 U7.46 U7.47 U7.48 U7.49 U7.50 U7.51 U7.52 U7.53 USBC1.1 USBC1.2 USBC1.3 USBC1.4 USBC1.A1B12 USBC1.B1A12
BOOT: BOOT.1 C19.2 R34.2 U7.23
EN: C18.2 EN.1 R27.2 U7.8

Pads without a net: SW1 3; U1 4 9 10 11; U7 4 6 7 9 10 15 16 17 18 20 24 25 28 29 32 33 34 35; USBC1 A8 B8

## Via types
v1: diameter 0.5, hole 0.305, Top Layer to Bottom Layer, 129 vias
v2: diameter 0.61, hole 0.305, Top Layer to Bottom Layer, 4 vias

## Routing (per net, layer and track width the routed paths; a pad name or vN(x,y) marks a point on that pad's centre or on a via; arc(x,y) is an arc through that point)
3.3V: length 23.5
  Top Layer w0.18: U6.B1 19.6,31.57 19.39,31.78
  Top Layer w0.2: C21.1 30.45,10.35 v1(30.37,10.43) ; v1(30.37,7.63) 30.46,7.72 C22.1
  Top Layer w0.254: v1(21.57,17.73) 21.57,19.58 C2.2 21.72,19.83 21.72,20.72 ; 21.72,20.72 U1.8 ; 21.72,20.72 21.77,20.78 23.92,20.78 24.1,20.96 24.1,21.75 23.82,22.03 U1.12 ; U1.5 19.97,23.03 C3.2 19.07,23.83 v1(19.07,24.23) ; 19.36,31.78 19.32,31.73 v1(19.32,28.79) ; R28.1 v1(33.34,1.38) ; 23.22,25.62 U1.1
  Top Layer w0.4: U7.3 41.12,21.48 C15.1
  vias: v1(23.22,25.68) v1(26.12,16.09) v1(27.77,16.08) v1(37.12,24.13) v1(39.52,24.13) v2(8.62,32.68) v2(8.62,30.62) v2(8.62,28.57) v2(11.41,32.68)
3.3V_BF: length 6.8
  Top Layer w0.254: R17.2 6.15,16.28 v1(6.16,16.28)
  Bottom Layer w0.254: v1(6.16,16.28) 6.16,17.13 8.8,19.77 v1(10.02,19.77)
GND: length 9.3
  Top Layer w0.18: C1.2 19.37,33.23 20.62,31.97 U6.A1
  Top Layer w0.254: R18.1 5.32,18.63 U2.3 ; 2.22,15.18 2.22,19.23
  Top Layer w0.5: C1.2 18.02,33.23
  vias: v1(0.83,11.04) v1(0.81,7) v1(2.77,24.28) v1(4.16,20.87) v1(4.24,16.88) v1(4.39,11.65) v1(4.81,20.87) v1(5,30.01) v1(5.8,20.88) v1(6.93,11.67) v1(7.21,20.65) v1(7.69,8.94) v1(8.42,22.99) v1(8.47,5.38) v1(8.65,18.55) v1(9.99,34.18) v1(10.12,6.08) v1(10.12,4.33) v1(10.25,24.76) v1(10.22,0.78) v1(10.62,13.33) v1(11.21,21.34) v1(12.27,14.63) v1(13.65,8.09) v1(14.87,10.68) v1(15,34.18) v1(15,15.01) v1(15.15,5.43) v1(15.25,24.76) v1(15.25,19.76) v1(17.01,25.2) v1(16.97,21.12) v1(18.13,34.23) v1(18.13,30.2) v1(18.14,28.1) v1(19.67,6.13) v1(20,20.01) v1(20,10.01) v1(20.25,24.76) v1(20.26,14.75) v1(20.59,28.78) v1(22.32,24.78) v1(23.08,28.79) v1(23.42,14.38) v1(24.21,34.2) v1(25,20.01) v1(25,10.01) v1(25.22,0.83) v1(25.85,23.51) v1(27.22,0.84) v1(27.67,4.13) v1(27.77,21.36) v1(29.16,19.5) v1(29.22,0.83) v1(29.67,13.83) v1(30.25,29.76) v1(30.25,19.76) v1(31.02,22.45) v1(32,24.31) v1(32.07,10.48) v1(32.07,7.58) v1(32.42,15.57) v1(33.61,5.32) v1(33.77,20.23) v1(34.52,0.83) v1(35,25.01) v1(35.02,17.93) v1(35,15.01) v1(35.23,34.19) v1(35.25,29.76) v1(35.25,4.76) v1(35.81,9.68) v1(36.17,20.23) v1(37.72,16.13) v1(37.72,10.18) v1(37.87,6.18) v1(39.23,2.51) v1(39.72,16.13) v1(40,10.01) v1(40.23,34.19) v1(40.26,29.75) v1(40.62,6.18) v1(42.12,20.6) v1(42.72,18.03) v1(42.72,15.03) v1(42.72,12.03) v1(42.72,9.03) v1(43.66,0.83)
BAT+: length 14
  Top Layer w0.5: P1.1 4.4,14.78 5.2,15.58 9.82,15.58 13.14,12.25 13.14,10.37 13.67,9.84 13.67,9.54
BAT_SENSE: length 30.5
  Top Layer w0.254: v1(10.88,16.18) 9.78,17.28 8.59,17.28 8.49,17.38 ; v1(35.17,13.23) 35.17,12.98 34.57,12.38 U7.19
  Bottom Layer w0.254: v1(10.88,16.18) 11.08,15.98 23.51,15.98 24.92,14.58 34.17,14.58 35.17,13.58 v1(35.17,13.23)
BOOT: length 19.1
  Top Layer w0.254: 23.42,12.19 23.28,12.33 20.77,12.33 ; R34.2 26.12,13.24 v1(25.42,12.54) 24.95,12.08 24.2,12.08 23.87,11.74 ; U7.23 34.52,9.18 34.97,9.63 v1(34.97,9.98)
  Bottom Layer w0.254: v1(34.97,9.98) 34.97,11.23 33.47,12.73 25.6,12.73 v1(25.42,12.54)
C_TYPE+: length 26.8
  Top Layer w0.2: D1.5 27.91,8.88 27.67,8.64 ; 27.67,8.64 27.67,10.68 28.42,11.43 28.67,11.43 ; 27.67,8.64 27.67,7.64 27.9,7.41 v1(29.58,7.41)
  Top Layer w0.5: 16.37,7.13 20.57,7.13 20.84,7.41 v1(24.82,7.41) 24.82,7.41 USBC1.A4B9 ; USBC1.B4A9 29.58,6.29 v1(29.58,7.41)
  Bottom Layer w0.5: v1(24.82,7.41) 24.82,5.88 25.67,5.03 28.72,5.03 29.58,5.89 v1(29.58,7.41)
D+: length 5.8
  Top Layer w0.2: 27.97,6.35 27.89,6.43 27.89,6.98 27.72,7.16 27.21,7.16 27.07,7.01 ; D1.1 26.67,9.83 27.07,9.43 27.07,7.01 ; 27.07,7.01 27.06,7.01 27.06,6.35 USBC1.A6
D+_P: length 9.4
  Top Layer w0.2: v1(35.7,8.88) 36.32,8.26 U7.27 ; D1.6 29.07,9.83 v1(29.62,9.28)
  Bottom Layer w0.2: v1(29.62,9.28) 29.68,9.21 35.37,9.21 v1(35.7,8.88)
D-: length 4.3
  Top Layer w0.2: USBC1.A7 27.47,5.6 27.22,5.35 26.71,5.35 26.42,5.65 26.42,6.2 USBC1.B7 26.47,7.73 D1.3
D-_P: length 8
  Top Layer w0.2: v1(29.62,8.48) 29.07,7.93 D1.4 ; v1(34.97,8.23) 35.52,7.68 U7.26
  Bottom Layer w0.2: v1(34.97,8.23) 34.92,8.23 34.57,8.58 29.72,8.58 v1(29.62,8.48)
DCDC_EN: length 20.5
  Top Layer w0.2: v1(3.27,19.75) 4.08,19.75 4.31,19.97 4.31,20.09
  Top Layer w0.254: 2.94,31.93 2.95,31.94 6.4,31.94
  Bottom Layer w0.2: SW1.1 4.22,30.53 4.22,27.23 3.82,26.83 1.82,26.83 1.47,26.48 1.47,23.58 2.02,23.03 2.02,21 v1(3.27,19.75)
EN: length 13.4
  Top Layer w0.254: C18.2 28.27,24.48 30.37,24.48 31.57,23.28 33.7,23.28 EN.1 33.75,22.79 34.52,22.03 36.62,22.03 37.12,21.53 R27.2
  Top Layer w0.4: U7.8 R27.2
RX: length 6.5
  Top Layer w0.254: U7.30 38.72,5.44 P3.2
SCL: length 1.9
  Top Layer w0.254: U7.13 32.42,17.18 R4.1
SDA: length 1.9
  Top Layer w0.254: U7.12 32.52,17.98 R3.2
TX: length 4.2
  Top Layer w0.254: U7.31 39.52,6.18 41,4.7 P3.1
VSYS: length 48.5
  Top Layer w0.254: 13.43,5.56 13.43,5.41 R8.1 14.86,1.81 R7.1 ; v1(11.47,9.69) 12.15,9.01 U3.5
  Top Layer w0.5: v1(1.47,22.77) 1.46,22.76 1.46,11.82 3.6,9.68 v1(3.62,9.68) 5.34,9.68 6.96,8.07 ; 6.96,8.07 6.96,8.06 ; 6.96,8.07 9.79,5.23 C5.1 13.09,5.23 ; 13.09,5.22 13.43,5.56 13.65,5.78 13.65,6.63
  Bottom Layer w0.2: v1(1.47,22.77) 0.92,23.32 0.92,28.03 SW1.2
  Bottom Layer w0.254: v1(3.62,9.68) 3.62,9.69 v1(11.47,9.69)
$1N2531: length 24.9
  Top Layer w0.2: v1(24.02,31.33) 22.15,31.33 21.51,31.97 U6.A2
  Top Layer w0.254: R4.2 29.51,17.88 26.78,17.88 R2.1 26.07,20.58 v1(24.77,21.88) 24.12,22.53 U1.13
  Bottom Layer w0.254: v1(24.77,21.88) 24.37,22.28 24.37,24.18 26.26,26.07 P2.1 26.26,29.09 v1(24.02,31.33)
$1N4169: length 11.7
  Top Layer w0.254: U3.9 12.89,6.58 v1(12.17,6.58) ; v1(20.77,4.03) 19.56,4.03 LED1.1
  Bottom Layer w0.254: v1(12.17,6.58) 14.72,4.03 v1(20.77,4.03)
$1N4171: length 15.6
  Top Layer w0.254: v1(20.77,1.83) 19.52,1.83 LED2.2 ; v1(10.73,7.87) 10.76,7.84 U3.7
  Bottom Layer w0.254: v1(20.77,1.83) 16.17,1.83 10.73,7.27 v1(10.73,7.87)
$1N4227: length 1.5
  Top Layer w0.254: LED2.1 17.86,1.79 16.35,1.79
$1N4266: length 1.5
  Top Layer w0.254: LED1.2 17.91,3.98 R8.2
$1N4379: length 5.4
  Top Layer w0.254: R9.2 17.06,13.22 16.32,12.48 16.32,11.73 15.82,11.23 15.82,10.18 15.22,9.59 U3.1
$1N4549: length 2.4
  Top Layer w0.254: R13.2 15.98,6.59 U3.12
$1N4656: length 3.7
  Top Layer w0.254: U3.16 16.22,9.91 16.22,10.93 R14.2
$1N4782: length 2.1
  Top Layer w0.254: U3.14 15.67,7.84 16.22,8.38 R12.2
$1N5007: length 2.8
  Top Layer w0.254: R15.2 17.06,9.83 15.57,8.34 U3.15
$1N5303: length 2
  Top Layer w0.3: L1.1 4.82,23.75 U2.9
$1N5309: length 2.4
  Top Layer w0.3: U2.7 5.82,22.43 6.76,23.38 L1.2
$1N5390: length 5.6
  Top Layer w0.254: v1(6.77,19.53) 6.77,19.65 U2.5 ; v1(4.07,17.93) 3.23,17.09 R16.2
  Bottom Layer w0.254: v1(6.77,19.53) 6.17,18.93 5.07,18.93 v1(4.07,17.93)
$1N5546: length 3.6
  Top Layer w0.254: U2.4 5.82,19.63 R18.2 6.98,18.47 R17.1
$1N10568: length 2.1
  Top Layer w0.4: R26.2 U7.5
$1N10729: length 6.8
  Top Layer w0.254: U7.22 33.77,10.03 33.37,10.03 32.87,9.53 32.87,4.87 33.34,4.39 R28.2
$1N11137: length 5.2
  Top Layer w0.254: LED3.1 32.62,13.53 33.02,13.13 33.02,11.13 33.37,10.78 U7.21
$1N11183: length 1.7
  Top Layer w0.254: LED3.2 30.91,15.08 R29.1
$1N11433: length 14.1
  Top Layer w0.2: v1(26.12,3.73) 25.97,3.88 USBC1.A5
  Top Layer w0.254: R30.2 36.77,1.68 v1(35.72,1.68)
  Bottom Layer w0.2: v1(35.72,1.68) 34.87,2.53 27.32,2.53 v1(26.12,3.73)
$1N11435: length 10.6
  Top Layer w0.2: v1(29.06,3.62) 29.06,6.16 USBC1.B5
  Top Layer w0.254: R31.2 36.77,3.28 v1(35.72,3.28)
  Bottom Layer w0.2: v1(29.06,3.62) 29.41,3.28 v1(35.72,3.28)
$1N15347: length 2.7
  Top Layer w0.254: U2.2 4.82,19.68 3.77,18.63 R32.2
$1N24447: length 25.4
  Top Layer w0.2: v1(25.62,30.78) 22.22,30.78 U6.B2
  Top Layer w0.254: U1.14 24.57,23.03 v1(24.97,22.63) 24.97,22.58 26.77,20.78 26.77,19.58 R1.1 27.92,18.43 R3.1
  Bottom Layer w0.254: v1(24.97,22.63) 24.97,23.83 28.76,27.62 P2.2 25.67,30.78 v1(25.62,30.78)

## Copper pours and planes (outline as drawn; the poured copper is in the pictures)
3.3V on Top Layer: 11.26,26.66 11.82,23.07 14.32,23.07 12.06,26.66
3.3V on Top Layer: 34.97,22.43 34.97,23.13 36.55,24.71 41.23,24.71 41.81,24.12 41.81,21.33 41.02,21.33 39.92,22.43
3.3V on Top Layer: 25.64,16.72 25.64,14.65 28.21,14.65 28.21,17.48 28.21,17.48 25.64,17.48 25.64,16.72
3.3V on Top Layer: 12.08,26.62 9.73,26.62 7.9,28.44 7.9,33.35 7.9,33.36 12.08,33.36
3.3V on Top Layer: 14.29,23.11 14.32,23.11 14.51,22.92 15.23,22.92 15.23,22.15 15.26,22.12 15.04,22.12 15.03,22.12 14.48,22.12 14.32,21.96 14.28,21.96 14.28,23.1
3.3V on Inner1: -0.2,34.94 -0.2,4.77 9.26,4.77 9.26,-0.07 49.8,-0.07 49.8,34.94
3.3V_BF on Top Layer: 6.32,22.2 9.55,22.2 9.55,21.08 7.85,21.08 7.62,21.31 6.32,21.31
3.3V_BF on Top Layer: 8.99,21.3 8.99,20.08 9.97,19.11 12.22,19.11 12.22,20.25 11.18,20.25 10.13,21.3
3.3V_BF on Top Layer: 11.82,19.22 11.82,19.11 12.16,19.11 12.76,18.51 12.76,18.46 13.65,18.46 13.65,18.51 14.25,19.11 14.32,19.11 14.32,19.17 14.27,19.22
GND on Top Layer: 0,35.22 0,4.8 9.45,4.8 9.45,0.21 50,0.21 50,35.22
GND on Bottom Layer: 0,35.01 0,4.79 9.46,4.79 9.46,0 50,0 50,35.01
GND on Inner2: 0.05,34.99 0.05,4.82 9.51,4.82 9.51,-0.02 50.05,-0.02 50.05,34.99
C_TYPE+ on Top Layer: 15.15,7.48 16.65,7.48 17.25,6.88 15.28,6.88 14.9,7.21
VSYS on Top Layer: 4.32,21.3 2.11,21.3 1.53,20.72 1.53,22.8 2.13,22.2 4.33,22.2 4.33,21.31
$1N6073 on Top Layer: 12.78,26.63 14.04,26.63 14.28,26.39 15.68,26.39 15.68,31.93 15.68,31.93 14.28,31.93 13.99,31.64 12.78,31.64

Small or netless copper shapes (teardrops, artwork), in the pictures only: 2 on Top Layer
